# EAGLE schematic Wordclock-main (EAGLE 6.0)
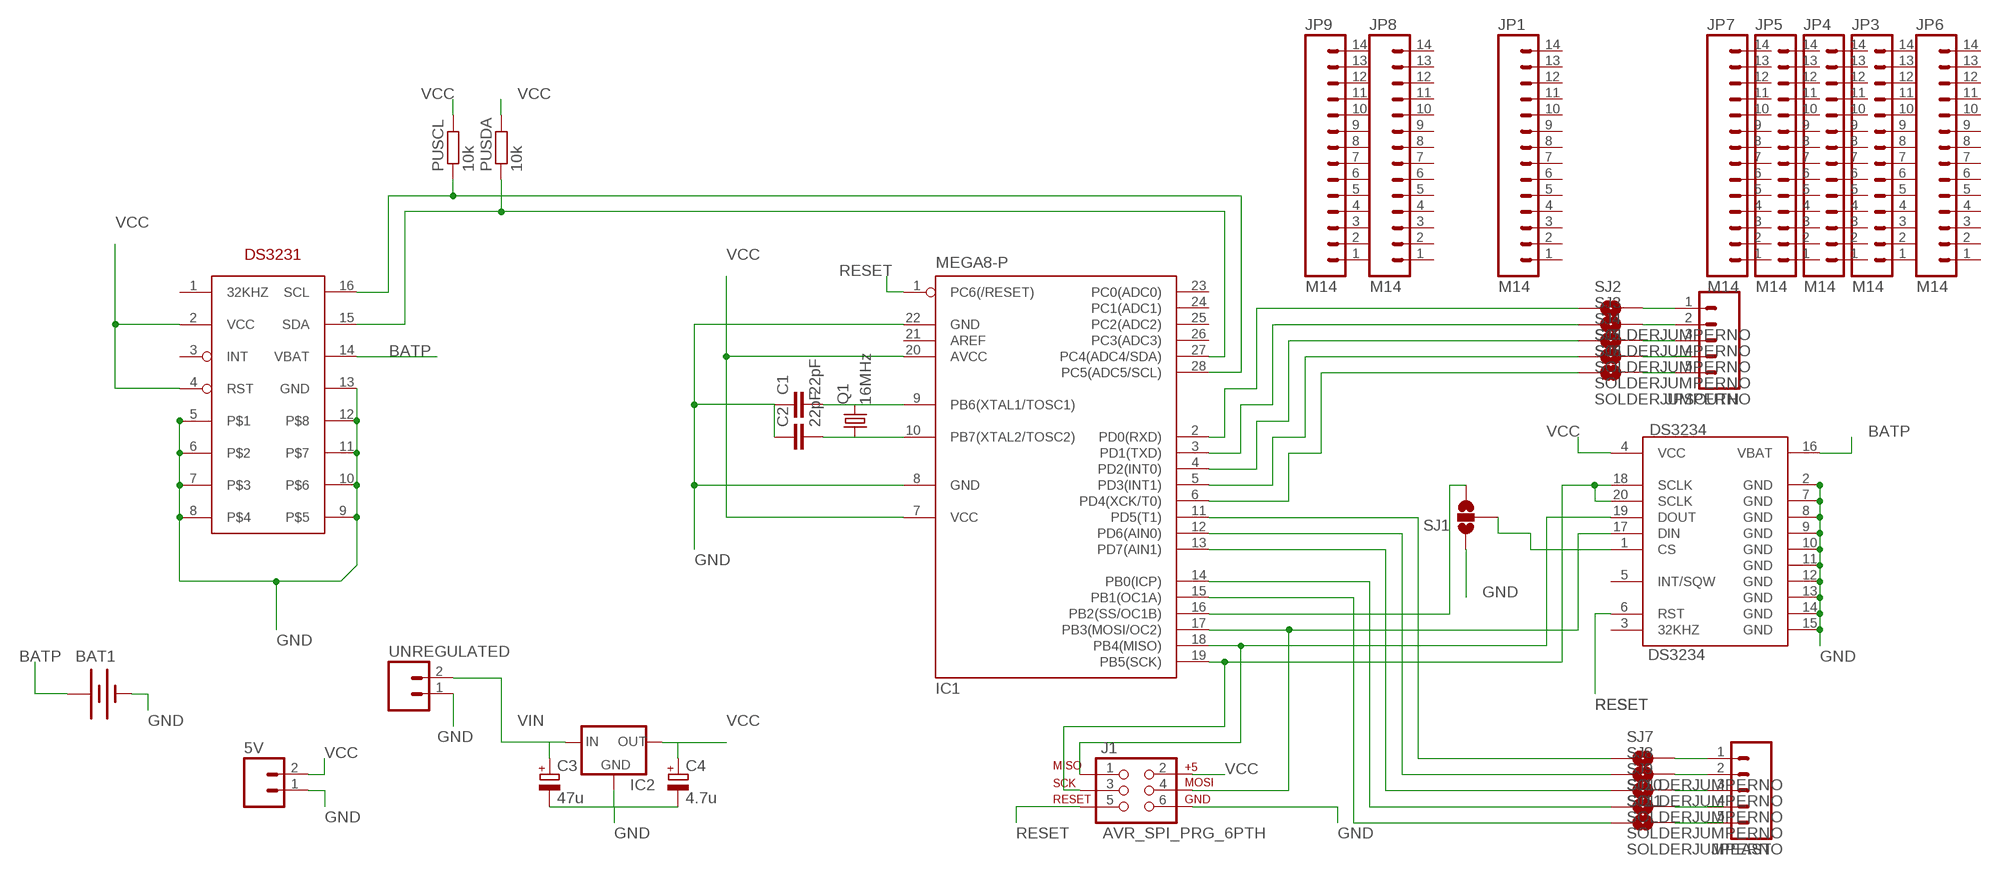
[diagram p0: schematic, sheet 1]

## Parts
5V  M02PTH3  [1X02_LONGPADS]
BAT1  BATTERY20PTH  [BATTCOM_20MM_PTH]
C1  22pF  C-EU025-024X044  [C025-024X044]
C2  22pF  C-EU025-024X044  [C025-024X044]
C3  47u  CPOL-EUE2,5-6E  [E2,5-6E]
C4  4.7u  CPOL-EUE2,5-6E  [E2,5-6E]
DS3234  DS3234  [DS3234]
IC1  MEGA8-P  [DIL28-3]
IC2  V_REG_78XXSIDE  [78XXL]
J1  AVR_SPI_PRG_6PTH  [2X3]
JP1  M14  [1X14]
JP3  M14  [1X14]
JP4  M14  [1X14]
JP5  M14  [1X14]
JP6  M14  [1X14]
JP7  M14  [1X14]
JP8  M14  [1X14]
JP9  M14  [1X14]
JPEAST  M05PTH  [1X05]
JPSOUTH  M05PTH  [1X05]
PUSCL  10k  R-EU_0204/5  [0204/5]
PUSDA  10k  R-EU_0204/5  [0204/5]
Q1  16MHz  CRYSTALHC49S  [HC49/S]
SJ1  SOLDERJUMPER_2WAYT  [SJ_2]
SJ2  SOLDERJUMPERNO  [SJ_2S-NO]
SJ3  SOLDERJUMPERNO  [SJ_2S-NO]
SJ4  SOLDERJUMPERNO  [SJ_2S-NO]
SJ5  SOLDERJUMPERNO  [SJ_2S-NO]
SJ6  SOLDERJUMPERNO  [SJ_2S-NO]
SJ7  SOLDERJUMPERNO  [SJ_2S-NO]
SJ8  SOLDERJUMPERNO  [SJ_2S-NO]
SJ9  SOLDERJUMPERNO  [SJ_2S-NO]
SJ10  SOLDERJUMPERNO  [SJ_2S-NO]
SJ11  SOLDERJUMPERNO  [SJ_2S-NO]
U$1  DS3231  [SO16]
UNREGULATED  M02PTH3  [1X02_LONGPADS]

## Nets
BATP: BAT1.1(+) DS3234.16(VBAT) U$1.14(VBAT)
GND: 5V.1 BAT1.2(-) C1.1 C2.1 C3.- C4.- DS3234.2(GND) DS3234.7(GND) DS3234.8(GND) DS3234.9(GND) DS3234.10(GND) DS3234.11(GND) DS3234.12(GND) DS3234.13(GND) DS3234.14(GND) DS3234.15(GND) IC1.8(GND) IC1.22(GND) IC2.GND J1.6 SJ1.1 U$1.5 U$1.6 U$1.7 U$1.8 U$1.9 U$1.10 U$1.11 U$1.12 U$1.13(GND) UNREGULATED.1
N$2: DS3234.1(CS) SJ1.2
N$3: JPEAST.1 SJ7.2
N$4: C1.2 IC1.9(PB6(XTAL1/TOSC1)) Q1.2
N$5: C2.2 IC1.10(PB7(XTAL2/TOSC2)) Q1.1
N$6: IC1.16(PB2(SS/OC1B)) SJ1.3
N$8: JPEAST.2 SJ8.2
N$9: JPEAST.3 SJ9.2
N$10: JPEAST.4 SJ10.2
N$11: JPEAST.5 SJ11.2
N$12: DS3234.18(SCLK) DS3234.20(SCLK) IC1.19(PB5(SCK)) J1.3
N$13: DS3234.19(DOUT) IC1.18(PB4(MISO)) J1.1
N$14: DS3234.17(DIN) IC1.17(PB3(MOSI/OC2)) J1.4
N$15: JPSOUTH.1 SJ2.2
N$16: JPSOUTH.2 SJ3.2
N$17: JPSOUTH.3 SJ4.2
N$18: JPSOUTH.4 SJ5.2
N$19: JPSOUTH.5 SJ6.2
N$20: IC1.2(PD0(RXD)) SJ2.1
N$21: IC1.3(PD1(TXD)) SJ3.1
N$22: IC1.4(PD2(INT0)) SJ4.1
N$23: IC1.5(PD3(INT1)) SJ5.1
N$24: IC1.6(PD4(XCK/T0)) SJ6.1
N$25: IC1.15(PB1(OC1A)) SJ11.1
N$26: IC1.14(PB0(ICP)) SJ10.1
N$27: IC1.13(PD7(AIN1)) SJ9.1
N$28: IC1.12(PD6(AIN0)) SJ8.1
N$29: IC1.11(PD5(T1)) SJ7.1
N$30: IC1.28(PC5(ADC5/SCL)) PUSCL.1 U$1.16(SCL)
N$31: IC1.27(PC4(ADC4/SDA)) PUSDA.1 U$1.15(SDA)
RESET: DS3234.6(RST) IC1.1(PC6(/RESET)) J1.5
VCC: 5V.2 C4.+ DS3234.4(VCC) IC1.7(VCC) IC1.20(AVCC) IC2.OUT J1.2 PUSCL.2 PUSDA.2 U$1.2(VCC) U$1.4(RST)
VIN: C3.+ IC2.IN UNREGULATED.2
Unconnected: DS3234.3(32KHZ) DS3234.5(INT/SQW) IC1.21(AREF) IC1.23(PC0(ADC0)) IC1.24(PC1(ADC1)) IC1.25(PC2(ADC2)) IC1.26(PC3(ADC3)) JP1.1 JP1.2 JP1.3 JP1.4 JP1.5 JP1.6 JP1.7 JP1.8 JP1.9 JP1.10 JP1.11 JP1.12 JP1.13 JP1.14 JP3.1 JP3.2 JP3.3 JP3.4 JP3.5 JP3.6 JP3.7 JP3.8 JP3.9 JP3.10 JP3.11 JP3.12 JP3.13 JP3.14 JP4.1 JP4.2 JP4.3 JP4.4 JP4.5 JP4.6 JP4.7 JP4.8 JP4.9 JP4.10 JP4.11 JP4.12 JP4.13 JP4.14 JP5.1 JP5.2 JP5.3 JP5.4 JP5.5 JP5.6 JP5.7 JP5.8 JP5.9 JP5.10 JP5.11 JP5.12 JP5.13 JP5.14 JP6.1 JP6.2 JP6.3 JP6.4 JP6.5 JP6.6 JP6.7 JP6.8 JP6.9 JP6.10 JP6.11 JP6.12 JP6.13 JP6.14 JP7.1 JP7.2 JP7.3 JP7.4 JP7.5 JP7.6 JP7.7 JP7.8 JP7.9 JP7.10 JP7.11 JP7.12 JP7.13 JP7.14 JP8.1 JP8.2 JP8.3 JP8.4 JP8.5 JP8.6 JP8.7 JP8.8 JP8.9 JP8.10 JP8.11 JP8.12 JP8.13 JP8.14 JP9.1 JP9.2 JP9.3 JP9.4 JP9.5 JP9.6 JP9.7 JP9.8 JP9.9 JP9.10 JP9.11 JP9.12 JP9.13 JP9.14 U$1.1(32KHZ) U$1.3(INT)

## Library data of the parts
5V UNREGULATED = SparkFun:M02: Header 2 Standard 2-pin 0.1" header. Use with straight break away headers (SKU : PRT-00116), right angle break away headers (PRT-00553), swiss pins (PRT-00743), machine pins (PRT-00117), and female headers (PRT-00115). Molex polarized connector foot print use with SKU : PRT-08233 with associated crimp pins and housings.
BAT1 = SparkFun:BATTERY: Battery Holders Various common sizes : AA, AAA, 20mm coin cell and 12mm coin cell.
C1 C2 = resistor:C-EU: CAPACITOR, European symbol
C3 C4 = resistor:CPOL-EU: POLARIZED CAPACITOR, European symbol
DS3234 = SparkFun:DS3234: DS3234 Real Time Clock
IC1 = atmel:MEGA8-P: MICROCONTROLLER 8 Kbytes FLASH, 1 kbytes SRAM, 512 bytes EEPROM, USART, 4-channel 10 bit ADC, 2-channel 8 bit ADC Pin compatible with Atmega48, ATMega88, ATMega168 Source: avr.lbr; OC_FARNELL: unknown; OC_NEWARK: unknown
IC2 = SparkFun:V_REG_78XX: Voltage Regulator Standard 7805 5V regulator. IGO (Input Ground Output). Spark Fun Electronics SKU : COM-00107
J1 = SparkFun:AVR_SPI_PRG_6: AVR ISP 6 Pin This is the reduced ISP connector for AVR programming. Common on Arduino. This footprint will take up less PCB space and can be used with a 10-pin to 6-pin adapter such as SKU: BOB-08508
JP1 JP3-JP9 = SparkFun:M14: Header 14 Standard 14-pin 0.1" header. Use with straight break away headers (SKU : PRT-00116), right angle break away headers (PRT-00553), swiss pins (PRT-00743), machine pins (PRT-00117), and female headers (PRT-00115).
JPEAST JPSOUTH = SparkFun:M05: Header 5 Standard 5-pin 0.1" header. Use with straight break away headers (SKU : PRT-00116), right angle break away headers (PRT-00553), swiss pins (PRT-00743), machine pins (PRT-00117), and female headers (PRT-00115). Molex polarized connector foot print use with SKU : PRT-08230 with associated crimp pins and housings.
PUSCL PUSDA = resistor:R-EU_: RESISTOR, European symbol
Q1 = crystal:CRYSTAL: CRYSTAL; OC_FARNELL: 1667008; OC_NEWARK: unknown
SJ1 = SparkFun:SOLDERJUMPER_2WAY: Solder Jumper 2 way solder jumper
SJ2-SJ11 = SparkFun:SOLDERJUMPER: Solder Jumper Standard SMD solder jumper. Used to automate production. Two varients : Normally Open and Normally Closed are the same, but have different paste layers. NC will have a large amount of paste and should jumper during reflow.
U$1 = DS3231:DS3231